# Altium schematic sheet Power_Supply.SchDoc
size A4; CompanyName: WEITI ISE; Address1: ul. Nowowiejska 15/19; Address2: 00-665 Warszawa; DocumentNumber: 6; SheetNumber: 6; SheetTotal: 7
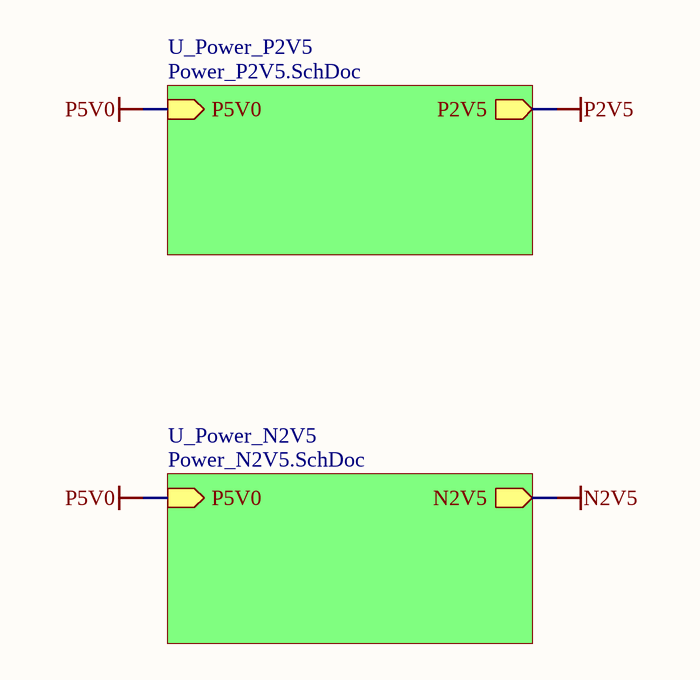
[diagram p0: Power_Supply.SchDoc]

## Sub-sheets
U_Power_N2V5 = Power_N2V5.SchDoc: P5V0 (in), N2V5 (out)
U_Power_P2V5 = Power_P2V5.SchDoc: P2V5 (out), P5V0 (in)

## Nets
N2V5: sheet U_Power_N2V5/N2V5
P2V5: sheet U_Power_P2V5/P2V5
P5V0: sheet U_Power_P2V5/P5V0, sheet U_Power_N2V5/P5V0

## Notes on the sheet
- Project:
- Title
- File:
- Drawn by:
- Engineer:
- Checked by:
- Szymon Jedliński
- Sheet:
- Revision:
- Total Sheet:
- 1.0
- Variant:
- Approved by:
- Date: